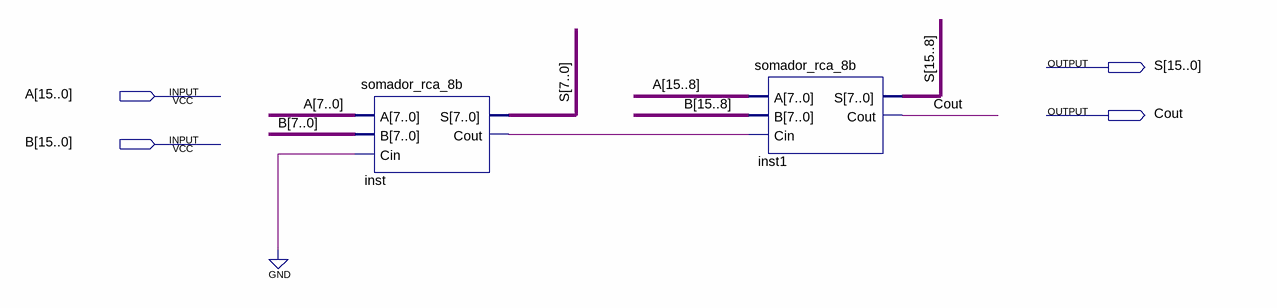
[diagram p0: schematic sheet]
// Quartus schematic somador_rca_16b.bdf as structural Verilog: 2 symbols, 4 pins
module somador_rca_16b (
  input  [15:0] A,
  input  [15:0] B,
  output [15:0] S,
  output Cout
);

  wire inst_cout;

  somador_rca_8b inst (.A(A[7:0]), .B(B[7:0]), .Cin(1'b0), .S(S[7:0]), .Cout(inst_cout));
  somador_rca_8b inst1 (.A(A[15:8]), .B(B[15:8]), .Cin(inst_cout), .S(S[15:8]), .Cout(Cout));
endmodule
